# Altium schematic sheet AMDC.SchDoc
size 635 x 393 mm; SheetNumber: 5; SheetTotal: 6
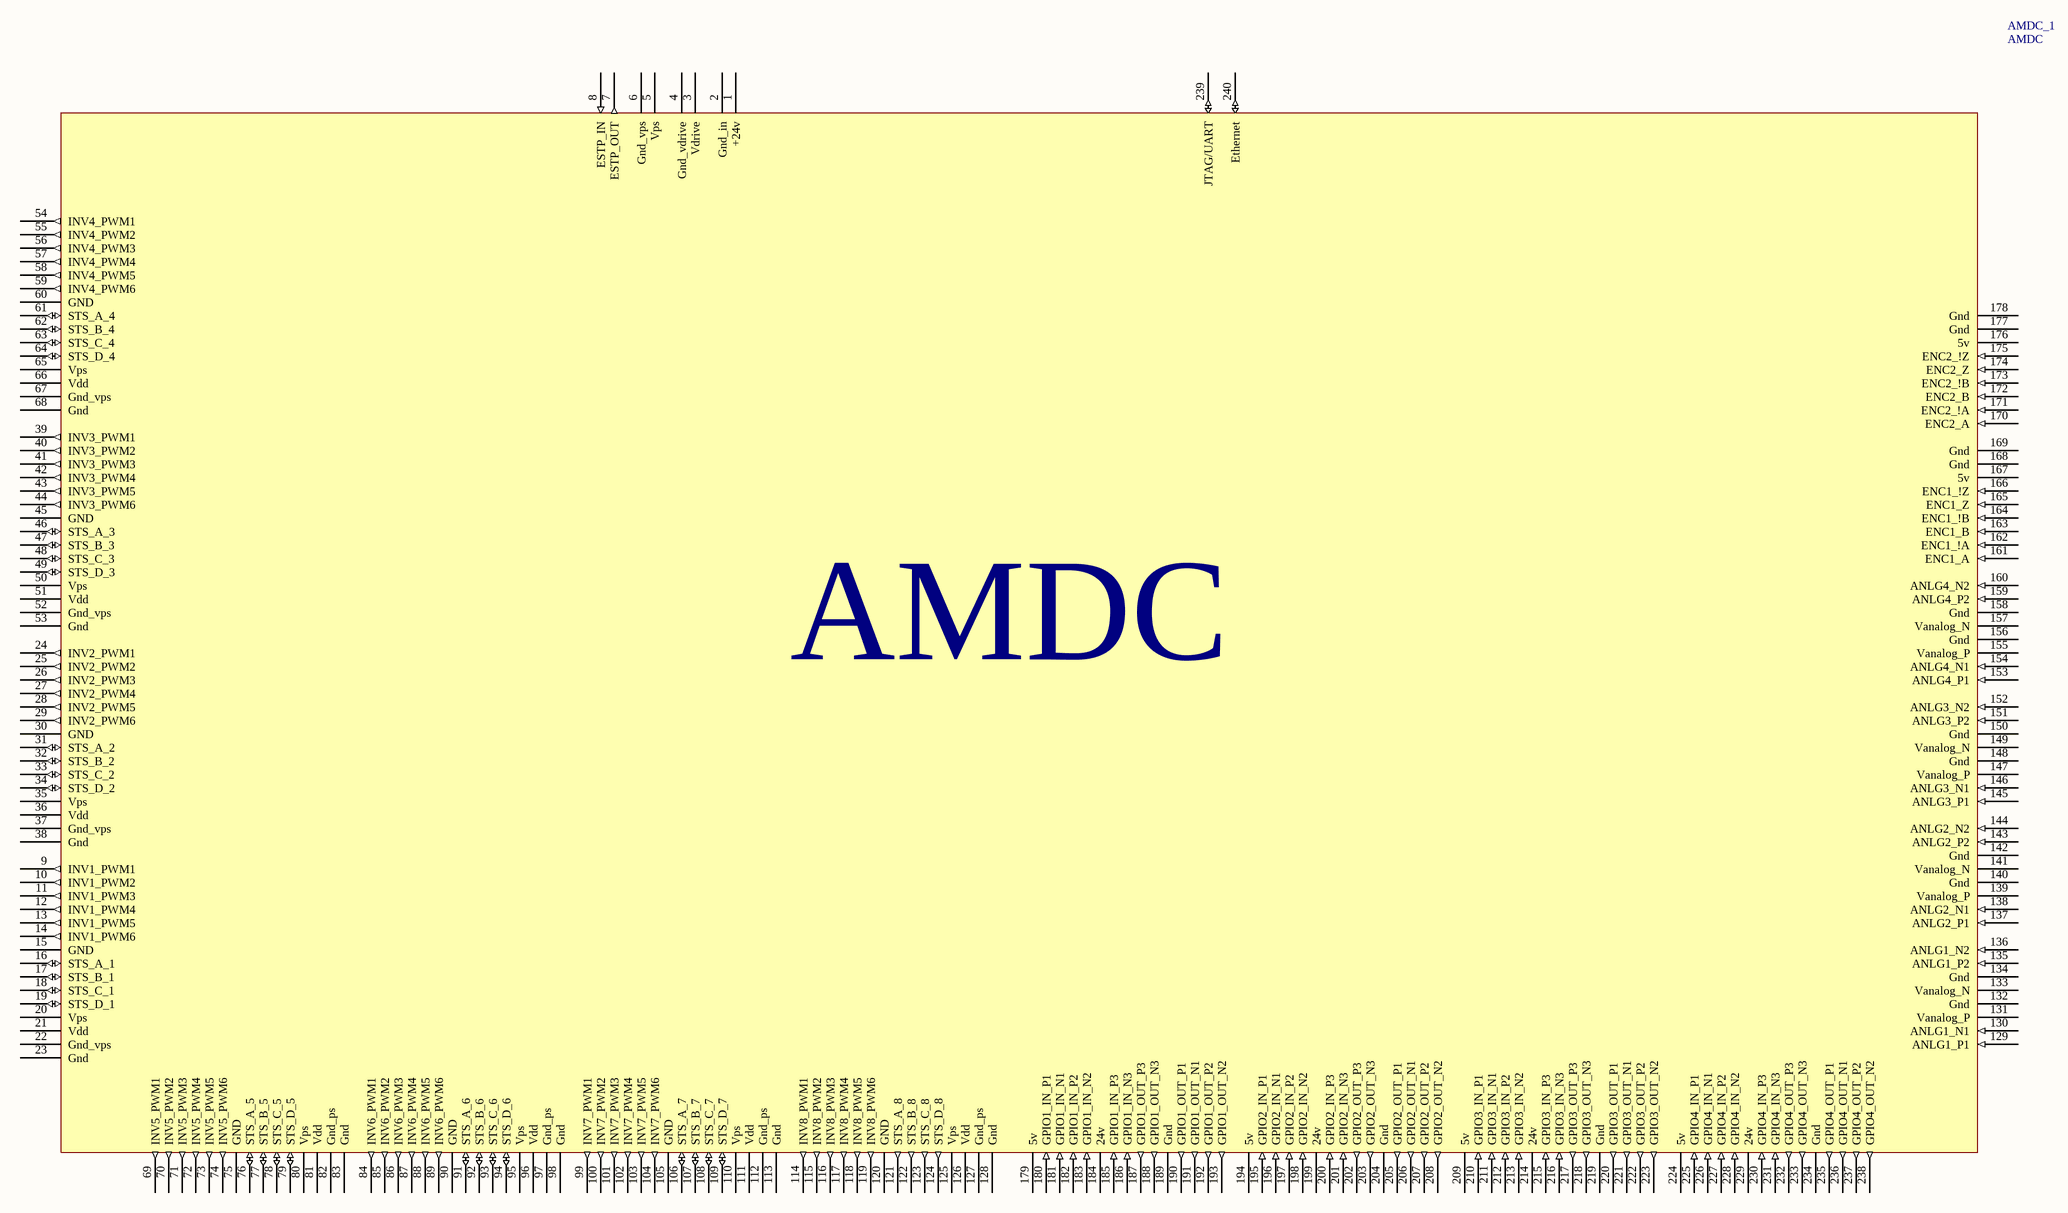
[diagram p0: AMDC.SchDoc]

## Parts
AMDC_1  AMDC

## Nets

Not connected (* = marked no-connect by the designer): AMDC_1 1(+24v) 2(Gnd_in) 3(Vdrive) 4(Gnd_vdrive) 5(Vps) 6(Gnd_vps) 7(ESTP_OUT) 8(ESTP_IN) 9(INV1_PWM1) 10(INV1_PWM2) 11(INV1_PWM3) 12(INV1_PWM4) 13(INV1_PWM5) 14(INV1_PWM6) 15(GND) 16(STS_A_1) 17(STS_B_1) 18(STS_C_1) 19(STS_D_1) 20(Vps) 21(Vdd) 22(Gnd_vps) 23(Gnd) 24(INV2_PWM1) 25(INV2_PWM2) 26(INV2_PWM3) 27(INV2_PWM4) 28(INV2_PWM5) 29(INV2_PWM6) 30(GND) 31(STS_A_2) 32(STS_B_2) 33(STS_C_2) 34(STS_D_2) 35(Vps) 36(Vdd) 37(Gnd_vps) 38(Gnd) 39(INV3_PWM1) 40(INV3_PWM2) 41(INV3_PWM3) 42(INV3_PWM4) 43(INV3_PWM5) 44(INV3_PWM6) 45(GND) 46(STS_A_3) 47(STS_B_3) 48(STS_C_3) 49(STS_D_3) 50(Vps) 51(Vdd) 52(Gnd_vps) 53(Gnd) 54(INV4_PWM1) 55(INV4_PWM2) 56(INV4_PWM3) 57(INV4_PWM4) 58(INV4_PWM5) 59(INV4_PWM6) 60(GND) 61(STS_A_4) 62(STS_B_4) 63(STS_C_4) 64(STS_D_4) 65(Vps) 66(Vdd) 67(Gnd_vps) 68(Gnd) 69(INV5_PWM1) 70(INV5_PWM2) 71(INV5_PWM3) 72(INV5_PWM4) 73(INV5_PWM5) 74(INV5_PWM6) 75(GND) 76(STS_A_5) 77(STS_B_5) 78(STS_C_5) 79(STS_D_5) 80(Vps) 81(Vdd) 82(Gnd_ps) 83(Gnd) 84(INV6_PWM1) 85(INV6_PWM2) 86(INV6_PWM3) 87(INV6_PWM4) 88(INV6_PWM5) 89(INV6_PWM6) 90(GND) 91(STS_A_6) 92(STS_B_6) 93(STS_C_6) 94(STS_D_6) 95(Vps) 96(Vdd) 97(Gnd_ps) 98(Gnd) 99(INV7_PWM1) 100(INV7_PWM2) 101(INV7_PWM3) 102(INV7_PWM4) 103(INV7_PWM5) 104(INV7_PWM6) 105(GND) 106(STS_A_7) 107(STS_B_7) 108(STS_C_7) 109(STS_D_7) 110(Vps) 111(Vdd) 112(Gnd_ps) 113(Gnd) 114(INV8_PWM1) 115(INV8_PWM2) 116(INV8_PWM3) 117(INV8_PWM4) 118(INV8_PWM5) 119(INV8_PWM6) 120(GND) 121(STS_A_8) 122(STS_B_8) 123(STS_C_8) 124(STS_D_8) 125(Vps) 126(Vdd) 127(Gnd_ps) 128(Gnd) 129(ANLG1_P1) 130(ANLG1_N1) 131(Vanalog_P) 132(Gnd) 133(Vanalog_N) 134(Gnd) 135(ANLG1_P2) 136(ANLG1_N2) 137(ANLG2_P1) 138(ANLG2_N1) 139(Vanalog_P) 140(Gnd) 141(Vanalog_N) 142(Gnd) 143(ANLG2_P2) 144(ANLG2_N2) 145(ANLG3_P1) 146(ANLG3_N1) 147(Vanalog_P) 148(Gnd) 149(Vanalog_N) 150(Gnd) 151(ANLG3_P2) 152(ANLG3_N2) 153(ANLG4_P1) 154(ANLG4_N1) 155(Vanalog_P) 156(Gnd) 157(Vanalog_N) 158(Gnd) 159(ANLG4_P2) 160(ANLG4_N2) 161(ENC1_A) 162(ENC1_!A) 163(ENC1_B) 164(ENC1_!B) 165(ENC1_Z) 166(ENC1_!Z) 167(5v) 168(Gnd) 169(Gnd) 170(ENC2_A) 171(ENC2_!A) 172(ENC2_B) 173(ENC2_!B) 174(ENC2_Z) 175(ENC2_!Z) 176(5v) 177(Gnd) 178(Gnd) 179(5v) 180(GPIO1_IN_P1) 181(GPIO1_IN_N1) 182(GPIO1_IN_P2) 183(GPIO1_IN_N2) 184(24v) 185(GPIO1_IN_P3) 186(GPIO1_IN_N3) 187(GPIO1_OUT_P3) 188(GPIO1_OUT_N3) 189(Gnd) 190(GPIO1_OUT_P1) 191(GPIO1_OUT_N1) 192(GPIO1_OUT_P2) 193(GPIO1_OUT_N2) 194(5v) 195(GPIO2_IN_P1) 196(GPIO2_IN_N1) 197(GPIO2_IN_P2) 198(GPIO2_IN_N2) 199(24v) 200(GPIO2_IN_P3) 201(GPIO2_IN_N3) 202(GPIO2_OUT_P3) 203(GPIO2_OUT_N3) 204(Gnd) 205(GPIO2_OUT_P1) 206(GPIO2_OUT_N1) 207(GPIO2_OUT_P2) 208(GPIO2_OUT_N2) 209(5v) 210(GPIO3_IN_P1) 211(GPIO3_IN_N1) 212(GPIO3_IN_P2) 213(GPIO3_IN_N2) 214(24v) 215(GPIO3_IN_P3) 216(GPIO3_IN_N3) 217(GPIO3_OUT_P3) 218(GPIO3_OUT_N3) 219(Gnd) 220(GPIO3_OUT_P1) 221(GPIO3_OUT_N1) 222(GPIO3_OUT_P2) 223(GPIO3_OUT_N2) 224(5v) 225(GPIO4_IN_P1) 226(GPIO4_IN_N1) 227(GPIO4_IN_P2) 228(GPIO4_IN_N2) 229(24v) 230(GPIO4_IN_P3) 231(GPIO4_IN_N3) 232(GPIO4_OUT_P3) 233(GPIO4_OUT_N3) 234(Gnd) 235(GPIO4_OUT_P1) 236(GPIO4_OUT_N1) 237(GPIO4_OUT_P2) 238(GPIO4_OUT_N2) 239(JTAG/UART) 240(Ethernet)

## Library data of the parts
AMDC_1 = CMP-001-0004-4: Advanced Motor Drive Controller